# Altium project Camera_nRF.PrjPcb
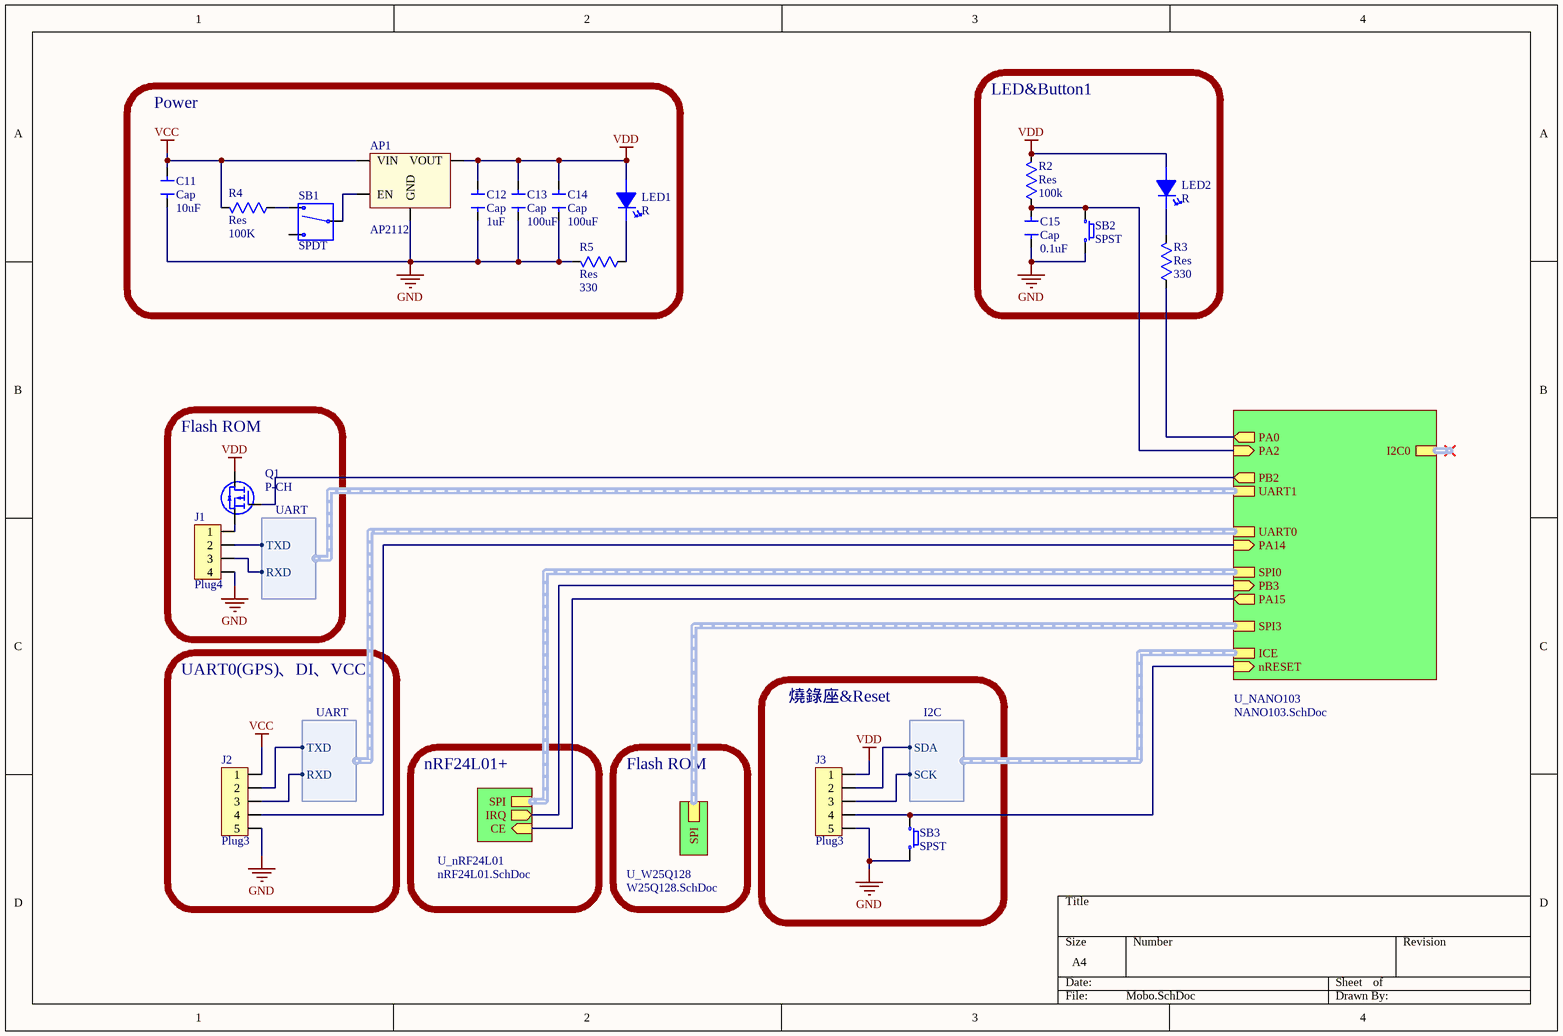
[diagram p0: Mobo.SchDoc]
4 sheets, 36 parts. Net scope: hierarchical (ports join the sheet entries above them; power ports are global).
Board file: PCB_Motherboard.PcbDoc
Sheets:
  Mobo.SchDoc
    U_nRF24L01 = nRF24L01.SchDoc
    U_NANO103 = NANO103.SchDoc
    U_W25Q128 = W25Q128.SchDoc

## Sheet Mobo.SchDoc
size A4

### Parts
AP1  AP2112  [SOT-23-5]
C11  Cap  value 10uF  [Cap_0603]
C12  Cap  value 1uF  [Cap_0603]
C13  Cap  value 100uF  [CAP_1206]
C14  Cap  value 100uF  [CAP_1206]
C15  Cap  value 0.1uF  [Cap_0603]
J1  Plug4  [JST_2.0mm_4pin_180]
J2  Plug3  [GH_1.25mm_Thru_5pin]
J3  Plug3  [GH_1.25mm_Thru_5pin]
LED1  R  [SMD-0603_LED]
LED2  R  [SMD-0603_LED]
Q1  Polarity: P-CH  [SOT-23]  (hidden comment: SI2301DS-T1)
R2  Res  value 100k  [RES_0603]
R3  Res  value 330  [RES_0603]
R4  Res  value 100K  [RES_0603]
R5  Res  value 330  [RES_0603]
SB1  SPDT  [SS-SK-02P]
SB2  SPST  [TACK-SW_SMD 2P 4x3mm_2]
SB3  SPST  [TACK-SW_SMD 2P 4x3mm_2]

### Blocks framed on the sheet
Power: AP1 C11-C14 LED1 R4 R5 SB1
LED&Button1: C15 LED2 R2 R3 SB2
Flash ROM: J1 Q1
UART0(GPS)、DI、VCC: J2
燒錄座&Reset: J3 SB3

### Sub-sheets
U_NANO103 = NANO103.SchDoc: SPI3 (harness SPI), UART1 (harness UART), I2C0 (harness I2C), nRESET (in), PB3 (in), PA14 (in), PA15 (out), PA2 (in), PA0 (out), ICE (harness I2C), SPI0 (harness SPI), PB2 (out), UART0 (harness UART)
U_nRF24L01 = nRF24L01.SchDoc: SPI (harness SPI), CE (in), IRQ (out)
U_W25Q128 = W25Q128.SchDoc: SPI (harness SPI)

### Harnesses
UART: TXD, RXD
I2C: SCK, SDA

### Nets
GND: AP1.2(GND) C11.2 C12.2 C13.2 C14.2 C15.1 J1.4 J2.5 J3.5 R5.1 SB2.1 SB3.2
VCC: AP1.1(VIN) C11.1 J2.1 R4.1
VDD: AP1.5(VOUT) C12.1 C13.1 C14.1 J3.1 LED1.1 LED2.1 Q1.1 R2.1  [project net VBAT]
CE: sheet U_nRF24L01/CE, sheet U_NANO103/PA15
ICE_CLK: J3.3 ; sheet U_NANO103/ICE.SCK
ICE_DAT: J3.2 ; sheet U_NANO103/ICE.SDA
IRQ: sheet U_nRF24L01/IRQ, sheet U_NANO103/PB3
nRESET: J3.4 SB3.1 ; sheet U_NANO103/nRESET
PA0: R3.2 ; sheet U_NANO103/PA0
PA2: C15.2 R2.2 SB2.2 ; sheet U_NANO103/PA2
PA14: J2.4 ; sheet U_NANO103/PA14
PB2: Q1.2 ; sheet U_NANO103/PB2
UART0_RX: J2.3 ; sheet U_NANO103/UART0.RXD
UART0_TX: J2.2 ; sheet U_NANO103/UART0.TXD
UART1_RX: J1.3 ; sheet U_NANO103/UART1.RXD
UART1_TX: J1.2 ; sheet U_NANO103/UART1.TXD
NetAP1_3: AP1.3(EN) SB1.2
NetJ1_1: J1.1 Q1.3
NetLED1_2: LED1.2 R5.2
NetLED2_2: LED2.2 R3.1
NetR4_2: R4.2 SB1.3

Not connected (* = marked no-connect by the designer): SB1 1

### Buses and harness runs
harness sheet U_NANO103/SPI0 = sheet U_nRF24L01/SPI
harness sheet U_NANO103/SPI3 = sheet U_W25Q128/SPI

### Notes on the sheet
- nRF24L01+
- Flash ROM

### Library data of the parts
J2 J3 = Plug5
LED1 LED2 = LED
Q1 = SI2301DS-T1: Trans MOSFET P-CH 20V 2.3A 3-Pin TO-236 T/R; pin to pad: 1>2 2>1; Manufacturer: Vishay Siliconix; Rise Time: 36ns; Drain to Source Resistance: 130mR; Gate to Source Voltage (Vgs): 8V; Max Power Dissipation: 1.25W; Turn-Off Delay Time: 42ns; Turn-On Delay Time: 13ns; Number of Elements: 1; Element Configuration: Single; Drain to Source Voltage (Vdss): -20V; Supplier 1: Component Sense; Manufacturer Part Number: SI2301DS-T1; RoHS: No; Category: MOSFETs; Stock 1: 12531; Pricing 1: 143=0.17500, 500=0.15000, 1000=0.10000, 5000=0.09000, 10000=0.08000 (USD); Mount: Surface Mount; Case/Package: SOT-23-3; Number of Pins: 3; Weight: 0.050717oz; Min Operating Temperature: -55°C; Max Operating Temperature: 150°C; Packaging: Tape and Reel; Package Quantity: 3000; Continuous Drain Current (ID): 2.3A; Fall Time: 36ns; Power Dissipation: 1.25W; Number of Channels: 1; Length: 3.04mm; Height: 1.02mm; Width: 1.4mm; ComponentLink1URL: https://datasheet.ciiva.com/13048/70627-115154-13048148.pdf?src-supplier=Mouser; ComponentLink1Description: https://datasheet.ciiva.com/13048/70627-115154-13048148.pdf?src-supplier=Mouser; Supplier Part Number 1: SI2301DS-T1
SB1 = Switch_Button2
SB2 SB3 = Switch_Button1

## Sheet nRF24L01.SchDoc
size A4
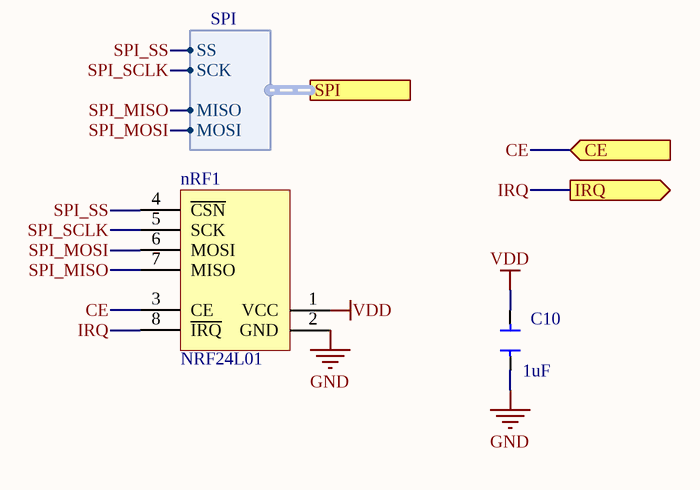
[diagram p1: nRF24L01.SchDoc]

### Parts
C10  value 1uF  [Cap_0603]  (hidden comment: Cap)
nRF1  NRF24L01  [NRF24L01P+PA+LNA+IPX]

### Ports
CE (in), IRQ (out), SPI (harness SPI)

### Harnesses
SPI: SS, SCK, MISO, MOSI

### Nets
GND: C10.2 nRF1.2(GND)
VDD: C10.1 nRF1.1(VCC)  [project net VBAT]
CE: nRF1.3(CE) ; port CE
IRQ: nRF1.8(~{IRQ}) ; port IRQ
SPI_MISO: nRF1.7(MISO) ; port SPI.MISO  [project net SPI0_MISO]
SPI_MOSI: nRF1.6(MOSI) ; port SPI.MOSI  [project net SPI0_MOSI]
SPI_SCLK: nRF1.5(SCK) ; port SPI.SCK  [project net SPI0_SCLK]
SPI_SS: nRF1.4(~{CSN}) ; port SPI.SS  [project net SPI0_SS]

### Library data of the parts
nRF1 = NRF24L01_module: pin to pad: 2>8 3>2 4>3 5>4 6>5 7>6 8>7

## Sheet NANO103.SchDoc
size A3
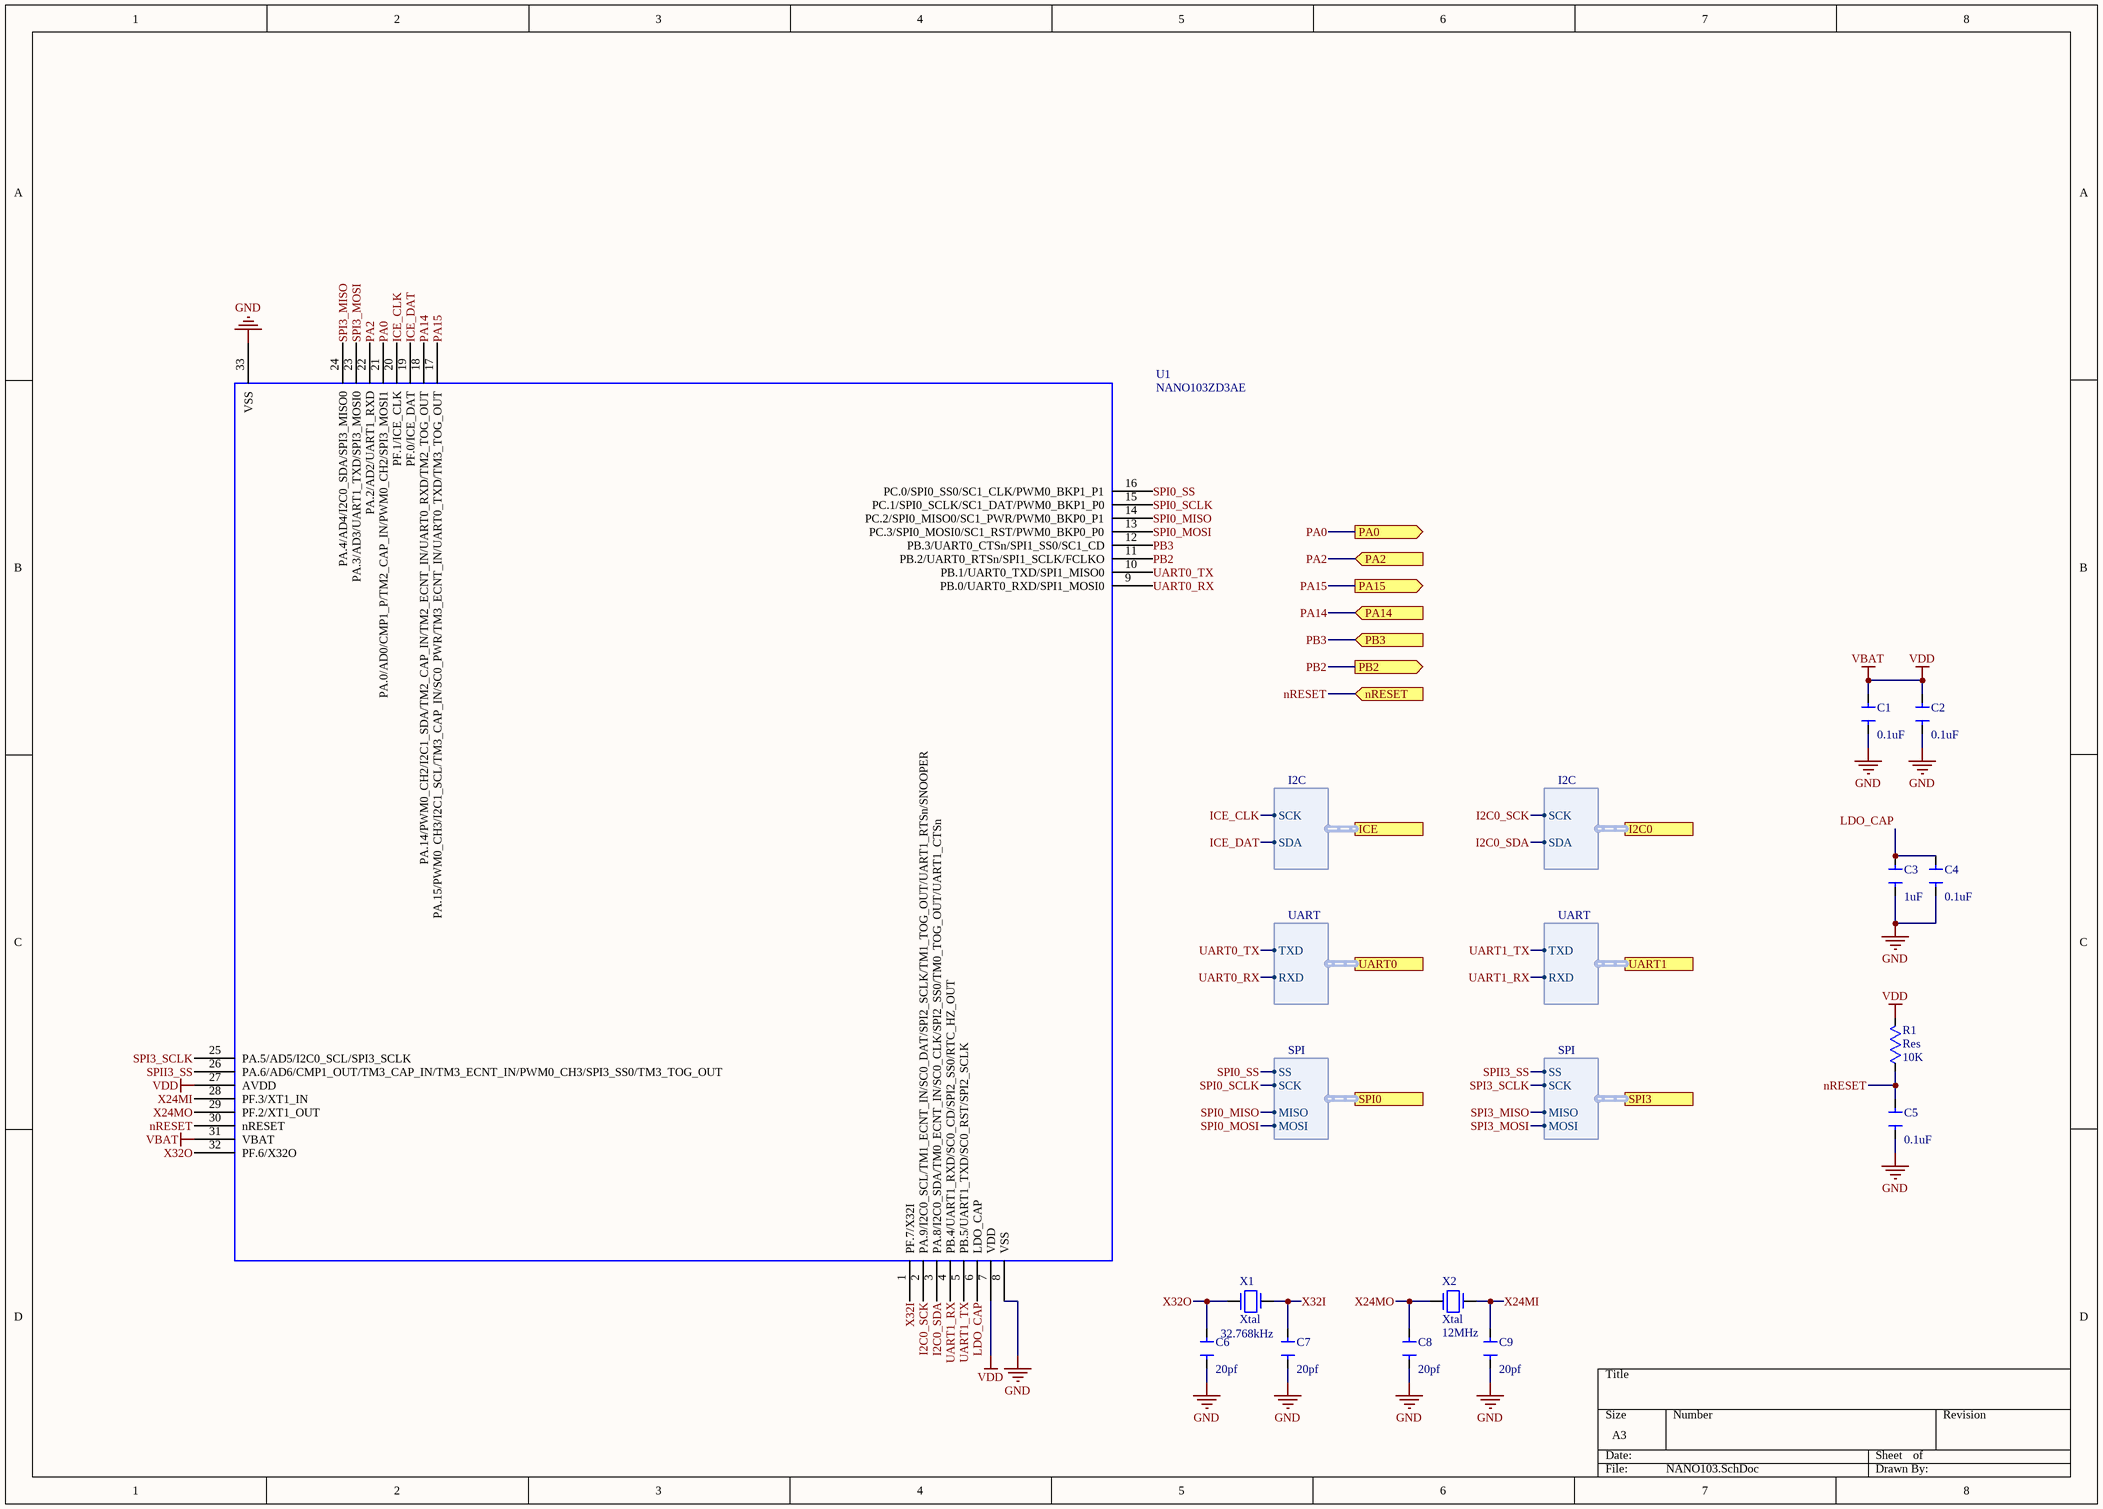
[diagram p2: NANO103.SchDoc]

### Parts
C1  value 0.1uF  [Cap_0603]  (hidden comment: Cap)
C2  value 0.1uF  [Cap_0603]  (hidden comment: Cap)
C3  value 1uF  [Cap_0603]  (hidden comment: Cap)
C4  value 0.1uF  [Cap_0603]  (hidden comment: Cap)
C5  value 0.1uF  [Cap_0603]  (hidden comment: Cap)
C6  value 20pf  [Cap_0603]  (hidden comment: Cap)
C7  value 20pf  [Cap_0603]  (hidden comment: Cap)
C8  value 20pf  [Cap_0603]  (hidden comment: Cap)
C9  value 20pf  [Cap_0603]  (hidden comment: Cap)
R1  Res  value 10K  [RES_0603]
U1  NANO103ZD3AE  [MCU_QFN_33_5x5]
X1  Xtal  value 32.768kHz  [X3215]
X2  Xtal  value 12MHz  [2520S]

### Ports
I2C0 (harness I2C), ICE (harness I2C), nRESET (in), PA0 (out), PA2 (in), PA14 (in), PA15 (out), PB2 (out), PB3 (in), SPI0 (harness SPI), SPI3 (harness SPI), UART0 (harness UART), UART1 (harness UART)

### Harnesses
SPI: SS, SCK, MISO, MOSI
UART: TXD, RXD
I2C: SCK, SDA

### Nets
GND: C1.2 C2.2 C3.2 C4.2 C5.2 C6.2 C7.2 C8.2 C9.2 U1.8(VSS) U1.33(VSS)
VBAT: C1.1 C2.1 R1.1 U1.7(VDD) U1.27(AVDD) U1.31(VBAT)  [also labelled VDD]
I2C0_SCK: U1.2(PA.9/I2C0_SCL/TM1_ECNT_IN/SC0_DAT/SPI2_SCLK/TM1_TOG_OUT/UART1_RTSn/SNOOPER) ; port I2C0.SCK
I2C0_SDA: U1.3(PA.8/I2C0_SDA/TM0_ECNT_IN/SC0_CLK/SPI2_SS0/TM0_TOG_OUT/UART1_CTSn) ; port I2C0.SDA
ICE_CLK: U1.20(PF.1/ICE_CLK) ; port ICE.SCK
ICE_DAT: U1.19(PF.0/ICE_DAT) ; port ICE.SDA
LDO_CAP: C3.1 C4.1 U1.6(LDO_CAP)
nRESET: C5.1 R1.2 U1.30(nRESET) ; port nRESET
PA0: U1.21(PA.0/AD0/CMP1_P/TM2_CAP_IN/PWM0_CH2/SPI3_MOSI1) ; port PA0
PA2: U1.22(PA.2/AD2/UART1_RXD) ; port PA2
PA14: U1.18(PA.14/PWM0_CH2/I2C1_SDA/TM2_CAP_IN/TM2_ECNT_IN/UART0_RXD/TM2_TOG_OUT) ; port PA14
PA15: U1.17(PA.15/PWM0_CH3/I2C1_SCL/TM3_CAP_IN/SC0_PWR/TM3_ECNT_IN/UART0_TXD/TM3_TOG_OUT) ; port PA15  [project net CE]
PB2: U1.11(PB.2/UART0_RTSn/SPI1_SCLK/FCLKO) ; port PB2
PB3: U1.12(PB.3/UART0_CTSn/SPI1_SS0/SC1_CD) ; port PB3  [project net IRQ]
SPI0_MISO: U1.14(PC.2/SPI0_MISO0/SC1_PWR/PWM0_BKP0_P1) ; port SPI0.MISO
SPI0_MOSI: U1.13(PC.3/SPI0_MOSI0/SC1_RST/PWM0_BKP0_P0) ; port SPI0.MOSI
SPI0_SCLK: U1.15(PC.1/SPI0_SCLK/SC1_DAT/PWM0_BKP1_P0) ; port SPI0.SCK
SPI0_SS: U1.16(PC.0/SPI0_SS0/SC1_CLK/PWM0_BKP1_P1) ; port SPI0.SS
SPI3_MISO: U1.24(PA.4/AD4/I2C0_SDA/SPI3_MISO0) ; port SPI3.MISO
SPI3_MOSI: U1.23(PA.3/AD3/UART1_TXD/SPI3_MOSI0) ; port SPI3.MOSI
SPI3_SCLK: U1.25(PA.5/AD5/I2C0_SCL/SPI3_SCLK) ; port SPI3.SCK
SPII3_SS: U1.26(PA.6/AD6/CMP1_OUT/TM3_CAP_IN/TM3_ECNT_IN/PWM0_CH3/SPI3_SS0/TM3_TOG_OUT) ; port SPI3.SS  [project net SPI_SS]
UART0_RX: U1.9(PB.0/UART0_RXD/SPI1_MOSI0) ; port UART0.RXD
UART0_TX: U1.10(PB.1/UART0_TXD/SPI1_MISO0) ; port UART0.TXD
UART1_RX: U1.4(PB.4/UART1_RXD/SC0_CD/SPI2_SS0/RTC_HZ_OUT) ; port UART1.RXD
UART1_TX: U1.5(PB.5/UART1_TXD/SC0_RST/SPI2_SCLK) ; port UART1.TXD
X24MI: C9.1 U1.28(PF.3/XT1_IN) X2.1
X24MO: C8.1 U1.29(PF.2/XT1_OUT) X2.2
X32I: C7.1 U1.1(PF.7/X32I) X1.1
X32O: C6.1 U1.32(PF.6/X32O) X1.2

### Library data of the parts
U1 = NANO103ZD3AE: OriginalSymbolOrigin: (0,0)

## Sheet W25Q128.SchDoc
size A4
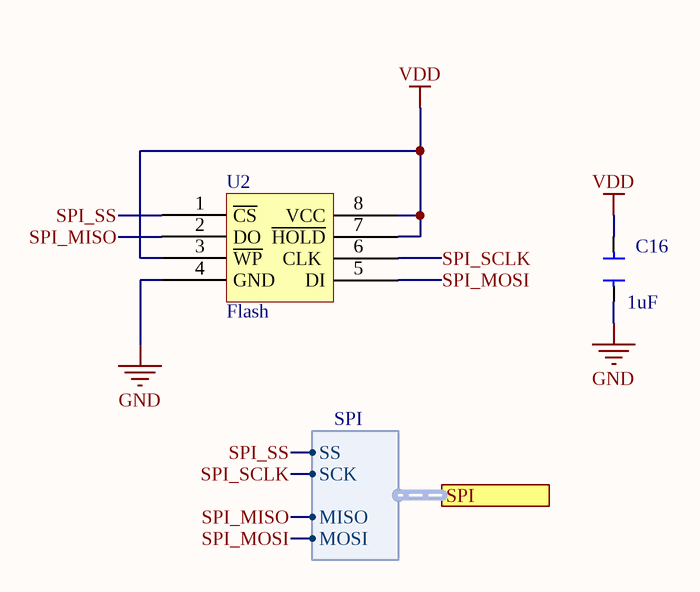
[diagram p3: W25Q128.SchDoc]

### Parts
C16  value 1uF  [Cap_0603]  (hidden comment: Cap)
U2  Flash  [8-Pin SOIC 208-mil]

### Ports
SPI (harness SPI)

### Harnesses
SPI: SS, SCK, MISO, MOSI

### Nets
GND: C16.2 U2.4(GND)
VDD: C16.1 U2.3(~{WP}) U2.7(~{HOLD}) U2.8(VCC)  [project net VBAT]
SPI_MISO: U2.2(DO) ; port SPI.MISO  [project net SPI3_MISO]
SPI_MOSI: U2.5(DI) ; port SPI.MOSI  [project net SPI3_MOSI]
SPI_SCLK: U2.6(CLK) ; port SPI.SCK  [project net SPI3_SCLK]
SPI_SS: U2.1(~{CS}) ; port SPI.SS

### Library data of the parts
U2 = W25QXX

## Nets that join several sheets
GND: Mobo (12 pins), nRF24L01 (C10.2 nRF1.2), NANO103 (11 pins), W25Q128 (C16.2 U2.4)
VBAT: Mobo (9 pins), nRF24L01 (C10.1 nRF1.1), NANO103 (6 pins), W25Q128 (C16.1 U2.3 U2.7 U2.8)
CE: nRF24L01 (nRF1.3), NANO103 (U1.17)
ICE_CLK: Mobo (J3.3), NANO103 (U1.20)
ICE_DAT: Mobo (J3.2), NANO103 (U1.19)
IRQ: nRF24L01 (nRF1.8), NANO103 (U1.12)
nRESET: Mobo (J3.4 SB3.1), NANO103 (C5.1 R1.2 U1.30)
PA0: Mobo (R3.2), NANO103 (U1.21)
PA2: Mobo (C15.2 R2.2 SB2.2), NANO103 (U1.22)
PA14: Mobo (J2.4), NANO103 (U1.18)
PB2: Mobo (Q1.2), NANO103 (U1.11)
SPI0_MISO: nRF24L01 (nRF1.7), NANO103 (U1.14)
SPI0_MOSI: nRF24L01 (nRF1.6), NANO103 (U1.13)
SPI0_SCLK: nRF24L01 (nRF1.5), NANO103 (U1.15)
SPI0_SS: nRF24L01 (nRF1.4), NANO103 (U1.16)
SPI3_MISO: NANO103 (U1.24), W25Q128 (U2.2)
SPI3_MOSI: NANO103 (U1.23), W25Q128 (U2.5)
SPI3_SCLK: NANO103 (U1.25), W25Q128 (U2.6)
SPI_SS: NANO103 (U1.26), W25Q128 (U2.1)
UART0_RX: Mobo (J2.3), NANO103 (U1.9)
UART0_TX: Mobo (J2.2), NANO103 (U1.10)
UART1_RX: Mobo (J1.3), NANO103 (U1.4)
UART1_TX: Mobo (J1.2), NANO103 (U1.5)